# EAGLE design Fonte Simétrica 12V (EAGLE 7.2.0)
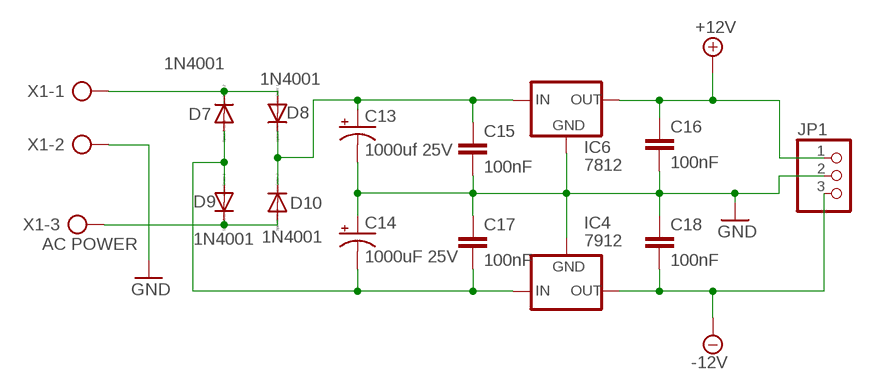
[diagram p0: schematic, sheet 1]

## Parts
C13  1000uf 25V  CPOL-USE5-10.5  [E5-10,5]
C14  1000uF 25V  CPOL-USE5-10.5  [E5-10,5]
C15  100nF  C-EU025-040X050  [C025-040X050]
C16  100nF  C-EU025-040X050  [C025-040X050]
C17  100nF  C-EU025-040X050  [C025-040X050]
C18  100nF  C-EU025-040X050  [C025-040X050]
D7  1N4001  1N4004  [DO41-10]
D8  1N4001  1N4004  [DO41-10]
D9  1N4001  1N4004  [DO41-10]
D10  1N4001  1N4004  [DO41-10]
IC4  7912  79XXS  [79XXS]
IC6  7812  78XXS  [78XXS]
JP1  PINHD-1X3  [1X03]
X1  AC POWER  AK500/3  [AK500/3]

## Nets
+12V: C16.1 IC6.OUT JP1.1
-12V: C18.2 IC4.OUT JP1.3
GND: C13.- C14.+ C15.2 C16.2 C17.1 C18.1 IC4.GND IC6.GND JP1.2 X1.2
N$23: C14.- C17.2 D7.A D9.A IC4.IN
N$24: C13.+ C15.1 D8.C D10.C IC6.IN
N$25: D7.C D8.A X1.1
N$26: D9.C D10.A X1.3

## Library data of the parts
C13 C14 = rcl:CPOL-US: POLARIZED CAPACITOR, American symbol
C15-C18 = rcl:C-EU: CAPACITOR, European symbol
D7-D10 = diode:1N4004: DIODE general purpose rectifier, 1 A
IC4 = v-reg:79XXS: VOLTAGE REGULATOR
IC6 = v-reg:78XXS: VOLTAGE REGULATOR
JP1 = pinhead:PINHD-1X3: PIN HEADER
X1 = con-ptr500:AK500/3: CONNECTOR; OC_FARNELL: unknown; OC_NEWARK: unknown

## Board
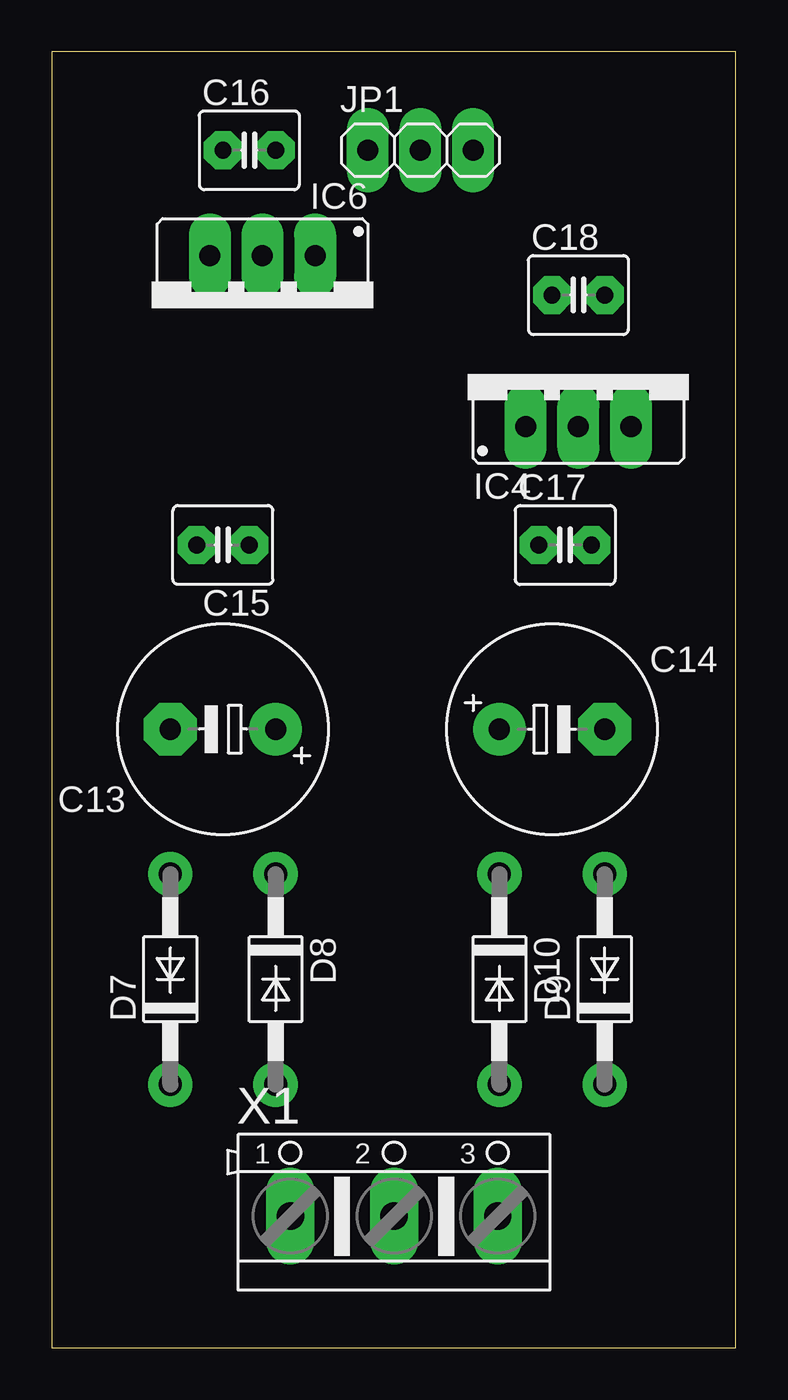
[diagram p1: board, top side]
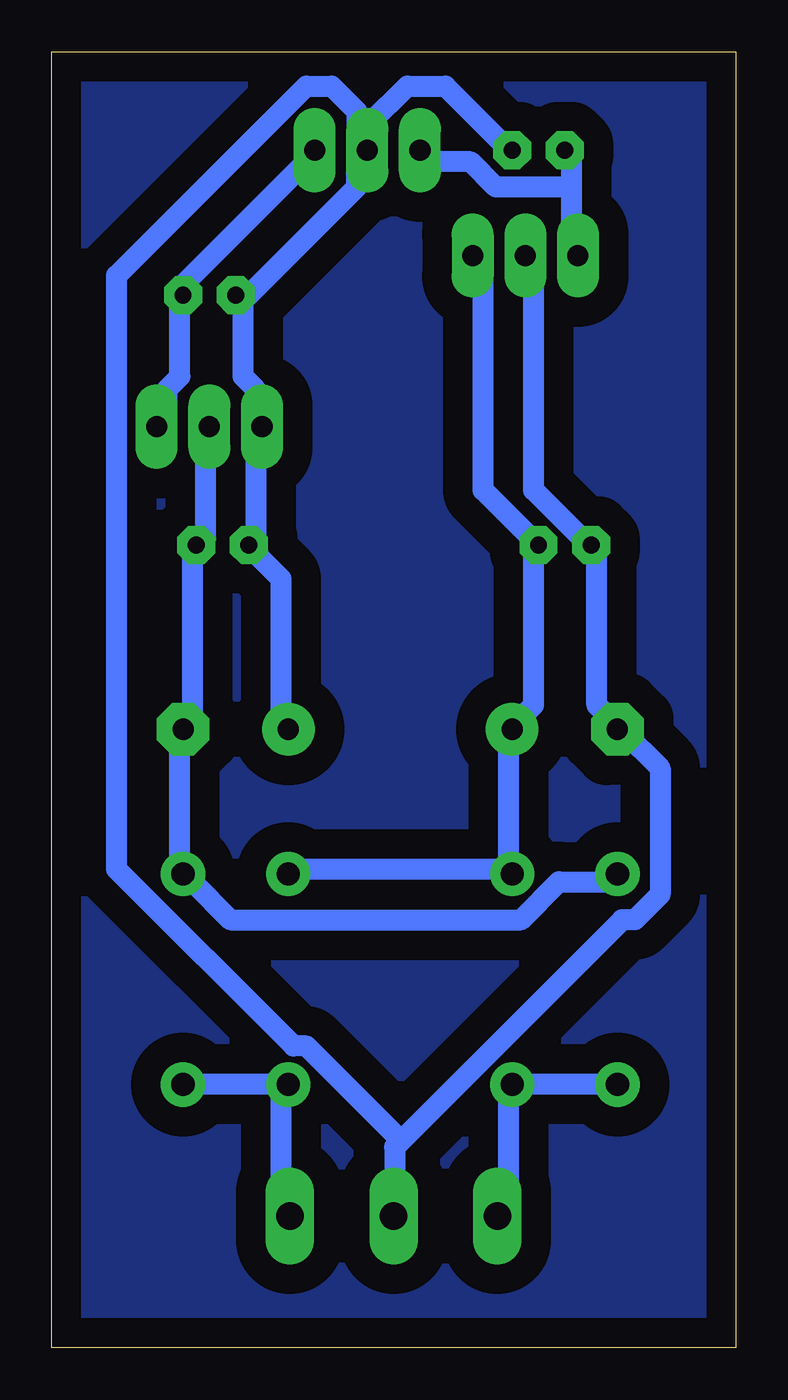
[diagram p2: board, bottom side, seen from below]

Size 33 x 62.53 mm. Coordinates in mm from the lower left corner, seen from the top.
Outline: 0,0 33,0 33,62.53 0,62.53 0,0
Copper layers (1*16): Top 0.035mm / dielectric 1.5mm / Bottom 0.035mm
Design rules "default": minimum track width 40mil, minimum drill 40mil, track to track 8mil, track to pad 8mil, pad to pad 8mil, via to via 8mil, smd to smd 8mil, copper to edge 40mil, drill to drill 8mil, minimum pad ring 20mil, minimum via ring 20mil, stop-mask expansion 4mil, vias tented up to drill 0mil, thermal gap 40mil

### Footprints (pad centres in the part's own frame; a part is rotated, then mirrored left to right if it is on the bottom)
E5-10,5 = drill 1.016 pad 2.54: + -2.54,0 | drill 1.016 pad 2.54 octagon: - 2.54,0
C025-040X050 = drill 0.813 octagon: 1 -1.27,0; 2 1.27,0
DO41-10 = drill 1.118: A 5.08,0; C -5.08,0
79XXS = drill 1.016 long: GND -2.54,-2.54; IN 0,-2.54; OUT 2.54,-2.54
78XXS = drill 1.016 long: GND 0,-2.54; IN -2.54,-2.54; OUT 2.54,-2.54
1X03 = drill 1.016 long: 1 -2.54,0; 2 0,0; 3 2.54,0
AK500/3 = drill 1.321 long: 1 -5.004,0; 2 0,0; 3 5.004,0

### Placement (x,y rotation side)
C13  8.26,29.84 180 top
C14  24.13,29.84 0 top
C15  8.26,38.73 180 top
C16  9.53,57.78 0 top
C17  24.77,38.73 0 top
C18  25.4,50.8 0 top
D7  5.71,17.78 90 top
D8  10.79,17.78 270 top
D9  26.67,17.78 90 top
D10  21.59,17.78 270 top
IC4  25.4,46.99 0 top
IC6  10.16,50.16 180 top
JP1  17.78,57.78 0 top
X1  16.51,6.35 0 top

### Tracks (layer width: path | path; a pad name or v marks a point on that pad's centre or on a via)
+12V
  Bottom 1.016: 7.92,56.01 7.92,52.96 IC6.OUT | 7.92,56.01 7.92,57.23 C16.1 | 7.92,56.01 11.58,56.01 12.8,57.23 15.24,57.23 JP1.1
-12V
  Bottom 1.016: IC4.OUT 27.43,45.03 27.43,46.25 26.82,46.86 26.82,50.52 C18.2 26.82,51.13 20.73,57.23 JP1.3
GND
  Bottom 1.016: C16.2 10.97,57.84 14.02,60.88 15.85,60.88 17.68,59.05 17.68,57.84 JP1.2 | 23.77,50.52 23.77,46.86 23.16,46.25 23.16,45.03 IC4.GND 23.16,44.42 23.16,38.94 C17.1 23.16,38.33 21.95,37.11 21.95,30.4 C14.+ | 23.77,50.52 18.29,56.01 18.29,57.23 JP1.2 | 23.77,50.52 C18.1 | IC6.GND 9.75,52.35 9.75,41.38 7.32,38.94 C15.2 6.71,38.33 6.71,31.01 6.1,30.4 C13.- 5.49,29.79 3.66,27.96 3.66,21.87 4.88,20.65 5.49,20.65 16.15,9.98 | 16.15,9.98 16.46,9.68 16.46,6.63 X1.2 | 16.15,9.98 20.73,14.55 21.34,14.55 29.87,23.09 29.87,51.74 20.73,60.88 19.51,60.88 18.29,59.66 18.29,57.84 JP1.2
N$1
  pour Bottom (isolate 1.422): 0.64,62.23 32.38,62.23 32.38,0.64 0.64,0.64
N$23
  Bottom 1.016: IC4.IN 25.6,44.42 25.6,38.94 C17.2 26.21,38.33 26.21,30.4 C14.- 26.82,29.79 26.82,23.09 D9.A 26.21,22.48 24.38,20.65 10.36,20.65 8.53,22.48 6.1,22.48 D7.A
N$24
  Bottom 1.016: IC6.IN 12.19,52.35 12.19,41.38 9.75,38.94 C15.1 9.75,38.33 9.75,31.01 10.36,30.4 C13.+ 10.97,29.79 10.97,23.09 | 10.97,23.09 21.34,23.09 D10.C | 10.97,23.09 D8.C
N$25
  Bottom 1.016: D7.C 6.1,12.73 10.36,12.73 D8.A 10.97,12.12 10.97,6.63 X1.1
N$26
  Bottom 1.016: D9.C 26.21,12.73 21.95,12.73 D10.A 21.95,12.12 21.95,6.63 X1.3